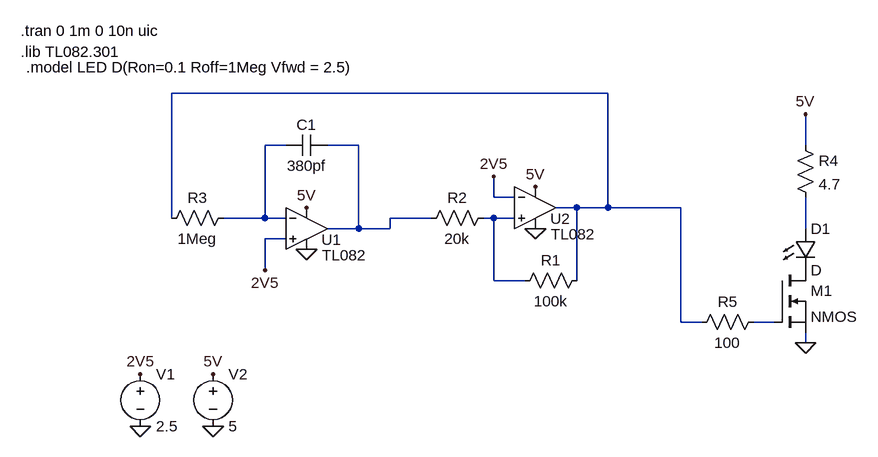
[diagram p0: schematic Opamp lt spice.asc]
Opamp lt spice.asc, the LTspice schematic file:
Version 4
SHEET 1 1084 680
WIRE 704 80 32 80
WIRE 208 160 176 160
WIRE 320 160 272 160
WIRE 1008 160 1008 112
WIRE 528 240 528 208
WIRE 560 240 528 240
WIRE 656 256 624 256
WIRE 704 256 704 80
WIRE 704 256 656 256
WIRE 816 256 704 256
WIRE 32 272 32 80
WIRE 176 272 176 160
WIRE 176 272 112 272
WIRE 208 272 176 272
WIRE 432 272 368 272
WIRE 528 272 512 272
WIRE 560 272 528 272
WIRE 320 288 320 160
WIRE 320 288 272 288
WIRE 368 288 368 272
WIRE 368 288 320 288
WIRE 1008 288 1008 240
WIRE 208 304 176 304
WIRE 176 352 176 304
WIRE 528 368 528 272
WIRE 576 368 528 368
WIRE 656 368 656 256
WIRE 816 432 816 256
WIRE 848 432 816 432
WIRE 960 432 928 432
WIRE 1008 464 1008 448
FLAG 240 320 0
FLAG 592 288 0
FLAG 240 256 5V
FLAG 592 224 5V
FLAG 528 208 2V5
FLAG 176 352 2V5
FLAG -16 592 0
FLAG 96 592 0
FLAG -16 512 2V5
FLAG 96 512 5V
FLAG 1008 464 0
FLAG 1008 112 5V
SYMBOL Res 528 256 R90
WINDOW 0 0 56 VBottom 2
WINDOW 3 32 56 VTop 2
SYMATTR InstName R2
SYMATTR Value 20k
SYMBOL Res 672 352 R90
WINDOW 0 0 56 VBottom 2
WINDOW 3 32 56 VTop 2
SYMATTR InstName R1
SYMATTR Value 100k
SYMBOL Res 128 256 R90
WINDOW 0 0 56 VBottom 2
WINDOW 3 32 56 VTop 2
SYMATTR InstName R3
SYMATTR Value 1Meg
SYMBOL voltage -16 496 R0
SYMATTR InstName V1
SYMATTR Value 2.5
SYMBOL voltage 96 496 R0
SYMATTR InstName V2
SYMATTR Value 5
SYMBOL Opamps/opamp2 240 224 R0
WINDOW 0 23 81 Left 2
WINDOW 3 24 105 Left 2
SYMATTR InstName U1
SYMATTR Value TL082
SYMBOL Opamps/opamp2 592 192 R0
WINDOW 0 23 81 Left 2
WINDOW 3 24 105 Left 2
SYMATTR InstName U2
SYMATTR Value TL082
SYMBOL Cap 272 144 R90
WINDOW 0 0 32 VBottom 2
WINDOW 3 32 32 VTop 2
SYMATTR InstName C1
SYMATTR Value 380pf
SYMBOL Res 992 144 R0
SYMATTR InstName R4
SYMATTR Value 4.7
SYMBOL Res 944 416 R90
WINDOW 0 0 56 VBottom 2
WINDOW 3 32 56 VTop 2
SYMATTR InstName R5
SYMATTR Value 100
SYMBOL LED 992 288 R0
SYMATTR InstName D1
SYMBOL nmos 960 352 R0
SYMATTR InstName M1
TEXT -200 -16 Left 2 !.tran 0 1m 0 10n uic
TEXT -200 16 Left 2 !.lib TL082.301
TEXT -192 40 Left 2 !.model LED D(Ron=0.1 Roff=1Meg Vfwd = 2.5)

The netlist it stands for:
* Opamp lt spice.asc
R2 N004 N003 20k
R1 N001 N004 100k
R3 N002 N001 1Meg
V1 2V5 0 2.5
V2 5V 0 5
XU1 2V5 N002 5V 0 N003 TL082  ; pins In+ In- V+ V- OUT
XU2 N004 2V5 5V 0 N001 TL082  ; pins In+ In- V+ V- OUT
C1 N003 N002 380pf
R4 5V N005 4.7
R5 N006 N001 100
D1 N005 P001 D
M1 P001 N006 0 0 NMOS
.model D D
.lib standard.dio
.model NMOS NMOS
.model PMOS PMOS
.lib standard.mos
.tran 0 1m 0 10n uic
.lib TL082.301
.model LED D(Ron=0.1 Roff=1Meg Vfwd = 2.5)
.backanno
.end